# EAGLE design OLED_Adapter_Alle_Bauteile (EAGLE 9.5.2)
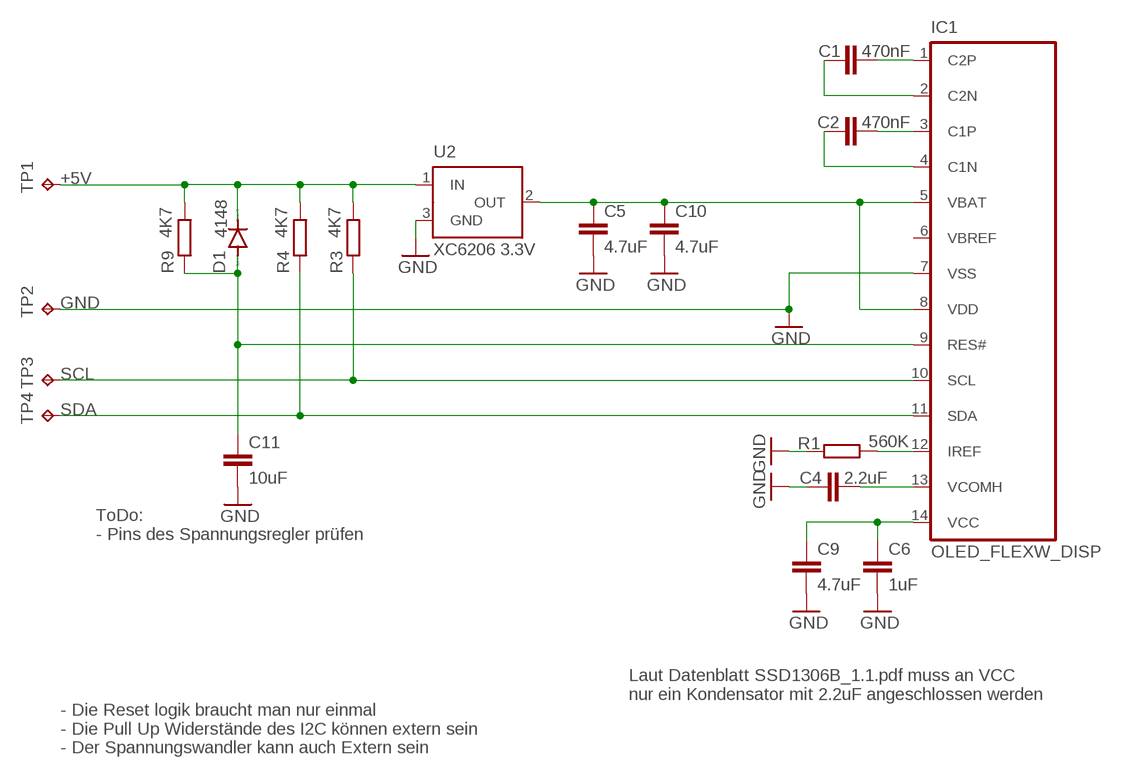
[diagram p0: schematic, sheet 1]

## Parts
C1  470nF  C-EUC0603  [C0603]
C2  470nF  C-EUC0603  [C0603]
C4  2.2uF  C-EUC0603  [C0603]
C5  4.7uF  C-EUC0603  [C0603]
C6  1uF  C-EUC0603  [C0603]
C9  4.7uF  C-EUC0603  [C0603]
C10  4.7uF  C-EUC0603  [C0603]
C11  10uF  C-EUC0603  [C0603]
D1  4148  CGRM4001-G  [SOD-123_MINI-SMA]
IC1  OLED_FLEXW_DISP  [OLED_FLEX_W_DISP]
R1  560K  R-EU_R0603  [R0603]
R3  4K7  R-EU_R0603  [R0603]
R4  4K7  R-EU_R0603  [R0603]
R9  4K7  R-EU_R0603  [R0603]
TP1  TPTP10SQ  [TP10SQ]
TP2  TPTP10R  [TP10R]
TP3  TPTP10R  [TP10R]
TP4  TPTP10R  [TP10R]
U2  XC6206 3.3V  MAX6520  [SOT23]

## Nets
+5V: D1.C R3.2 R4.2 R9.2 TP1.TP U2.1(IN)
GND: C4.1 C5.2 C6.2 C9.2 C10.2 C11.2 IC1.7(VSS) R1.1 TP2.TP U2.3(GND)
N$1: IC1.12(IREF) R1.2
N$2: C5.1 C10.1 IC1.5(VBAT) IC1.8(VDD) U2.2(OUT)
N$3: C1.2 IC1.1(C2P)
N$4: C1.1 IC1.2(C2N)
N$5: C2.2 IC1.3(C1P)
N$6: C2.1 IC1.4(C1N)
N$7: C6.1 C9.1 IC1.14(VCC)
N$8: C4.2 IC1.13(VCOMH)
N$12: C11.1 D1.A IC1.9(RES#) R9.1
SCL: IC1.10(SCL) R3.1 TP3.TP
SDA: IC1.11(SDA) R4.1 TP4.TP
Unconnected: IC1.6(VBREF)

## Notes on the sheet
- ToDo:
  - Pins des Spannungsregler prüfen
- Laut Datenblatt SSD1306B_1.1.pdf muss an VCC
  nur ein Kondensator mit 2.2uF angeschlossen werden
- - Die Reset logik braucht man nur einmal
  - Die Pull Up Widerstände des I2C können extern sein
  - Der Spannungswandler kann auch Extern sein

## Library data of the parts
C1 C2 C4-C6 C9-C11 = resistor:C-EU: CAPACITOR, European symbol
D1 = diode:CGRM400*-G: Molded plasitc,JEDEC SOD-123/Mini SMA Source: Comchip CGRM4001-G.pdf
IC1 = OLED_Flex:OLED_FLEX: 14-Pin OLED Conector 0.91" or 0.86 " Source: https://www.buydisplay.com/white-0-87-inch-oled-display-panel-128x32-iic-i2c-ssd1316 ER-OLED0.87-1_Datasheet.pdf by Hardi
R1 R3 R4 R9 = rcl:R-EU_: RESISTOR, European symbol; SPICEPREFIX: R
TP1-TP4 = testpad:TP: Test pad
U2 = maxim:MAX6520: 1.2V Voltage Reference 50ppm/°C, SOT23, 3-Terminal Source: Data sheet <http://datasheets.maxim-ic.com/en/ds/MAX6520.pdf>; MF: MAXIM; MPN: MAX6520EUR-T; OC_FARNELL: unknown; OC_NEWARK: 02J4586

## Board
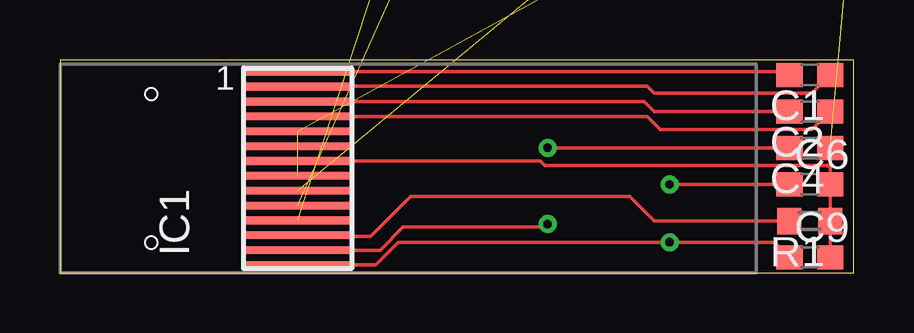
[diagram p1: board, top side]
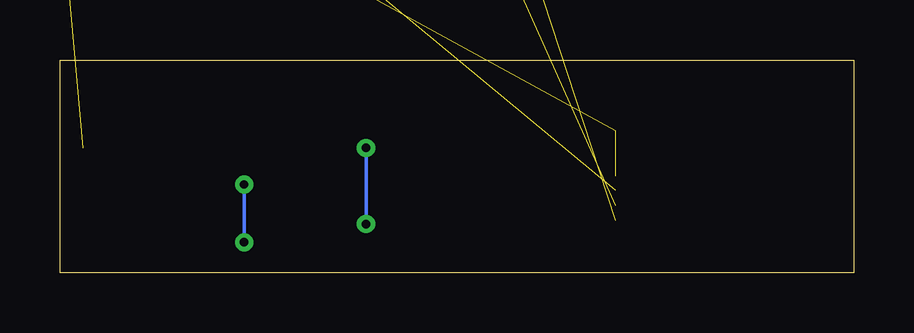
[diagram p2: board, bottom side, seen from below]

Size 33.07 x 8.88 mm. Coordinates in mm from the lower left corner, seen from the top.
Outline: 0,0 33.07,0 33.07,8.88 0,8.88 0,0
Copper layers (1*16): Top 0.035mm / dielectric 1.5mm / Bottom 0.035mm
Design rules "default": minimum track width 6mil, minimum drill 0.35mm, track to track 6mil, track to pad 6mil, pad to pad 6mil, via to via 6mil, smd to smd 6mil, copper to edge 40mil, drill to drill 6mil, minimum pad ring 10mil, minimum via ring 8mil, stop-mask expansion 4mil, vias tented up to drill 0mil, thermal gap 10mil

### Footprints (pad centres in the part's own frame; a part is rotated, then mirrored left to right if it is on the bottom)
C0603 = smd 1.1 x 1: 1 -0.85,0; 2 0.85,0
SOD-123_MINI-SMA = smd 1.5 x 2.1: A 1.8,0; C -1.8,0
OLED_FLEX_W_DISP = smd 4.5 x 0.32: 1 0,0; 2 0,-0.62; 3 0,-1.24; 4 0,-1.86; 5 0,-2.48; 6 0,-3.1; 7 0,-3.72; 8 0,-4.34; 9 0,-4.96; 10 0,-5.58; 11 0,-6.2; 12 0,-6.82; 13 0,-7.44; 14 0,-8.06
R0603 = smd 1 x 1.1: 1 -0.85,0; 2 0.85,0
TP10SQ = smd 1 x 1: TP 0,0
TP10R = smd 1 x 1: TP 0,0
SOT23 = smd 1 x 1.4: 1 -0.95,-1.1; 2 0.95,-1.1; 3 0,1.1

### Placement (x,y rotation side)
C1  31.24,8.26 180 top
C2  31.24,6.73 180 top
C4  31.24,5.21 180 top
C5  31.75,24.13 90 top  (outside the outline)
C6  31.24,3.68 0 top
C9  31.24,0.64 0 top
C10  32.38,17.78 0 top  (outside the outline)
C11  43.18,31.75 180 top  (outside the outline)
D1  43.18,35.56 0 top  (outside the outline)
IC1  9.91,8.38 0 top
R1  31.24,2.16 180 top
R3  30.48,46.99 0 top  (outside the outline)
R4  25.4,46.99 0 top  (outside the outline)
R9  43.18,39.37 180 top  (outside the outline)
TP1  33.02,50.8 0 top  (outside the outline)
TP2  27.94,50.8 0 top  (outside the outline)
TP3  22.86,50.8 0 top  (outside the outline)
TP4  43.18,55.88 0 top  (outside the outline)
U2  27.94,24.13 0 top  (outside the outline)

### Tracks (layer width: path | path; a pad name or v marks a point on that pad's centre or on a via)
+5V  (5 unrouted)
GND  (5 unrouted)
  Top 0.152: C4.1 32.09,4.45 | 32.09,4.45 C6.2 R1.1 C9.2 | IC1.7 20.01,4.66 20.19,4.48 31.95,4.48 31.98,4.45 32.09,4.45
N$1
  Top 0.152: R1.2 24.77,2.16 23.75,3.17 14.61,3.17 12.95,1.52 9.94,1.52 IC1.12
N$2  (4 unrouted)
N$3
  Top 0.152: IC1.1 30.27,8.38 C1.2
N$4
  Top 0.152: C1.1 31.33,7.49 24.77,7.49 24.47,7.79 9.93,7.79 IC1.2
N$5
  Top 0.152: C2.2 24.77,6.73 24.35,7.14 IC1.3
N$6
  Top 0.152: C2.1 31.33,5.97 25.02,5.97 24.47,6.52 IC1.4
N$7  (via drill 0.35)
  Top 0.152: v25.4,3.68 C6.1 | C9.1 29.76,1.27 v25.4,1.27 14.09,1.27 13.15,0.32 IC1.14
  Bottom 0.152: v25.4,1.27 v25.4,3.68
N$8  (via drill 0.35)
  Top 0.152: IC1.13 13.34,0.94 14.3,1.91 20.2,1.91 v20.32,2.03 20.32,1.91 | v20.32,5.21 C4.2
  Bottom 0.152: v20.32,2.03 v20.32,5.21
N$12  (3 unrouted)
SCL  (2 unrouted)
SDA  (2 unrouted)